# Altium project ARDUINO_BASED_DEVELOPMENT_BOAD.PrjPcb
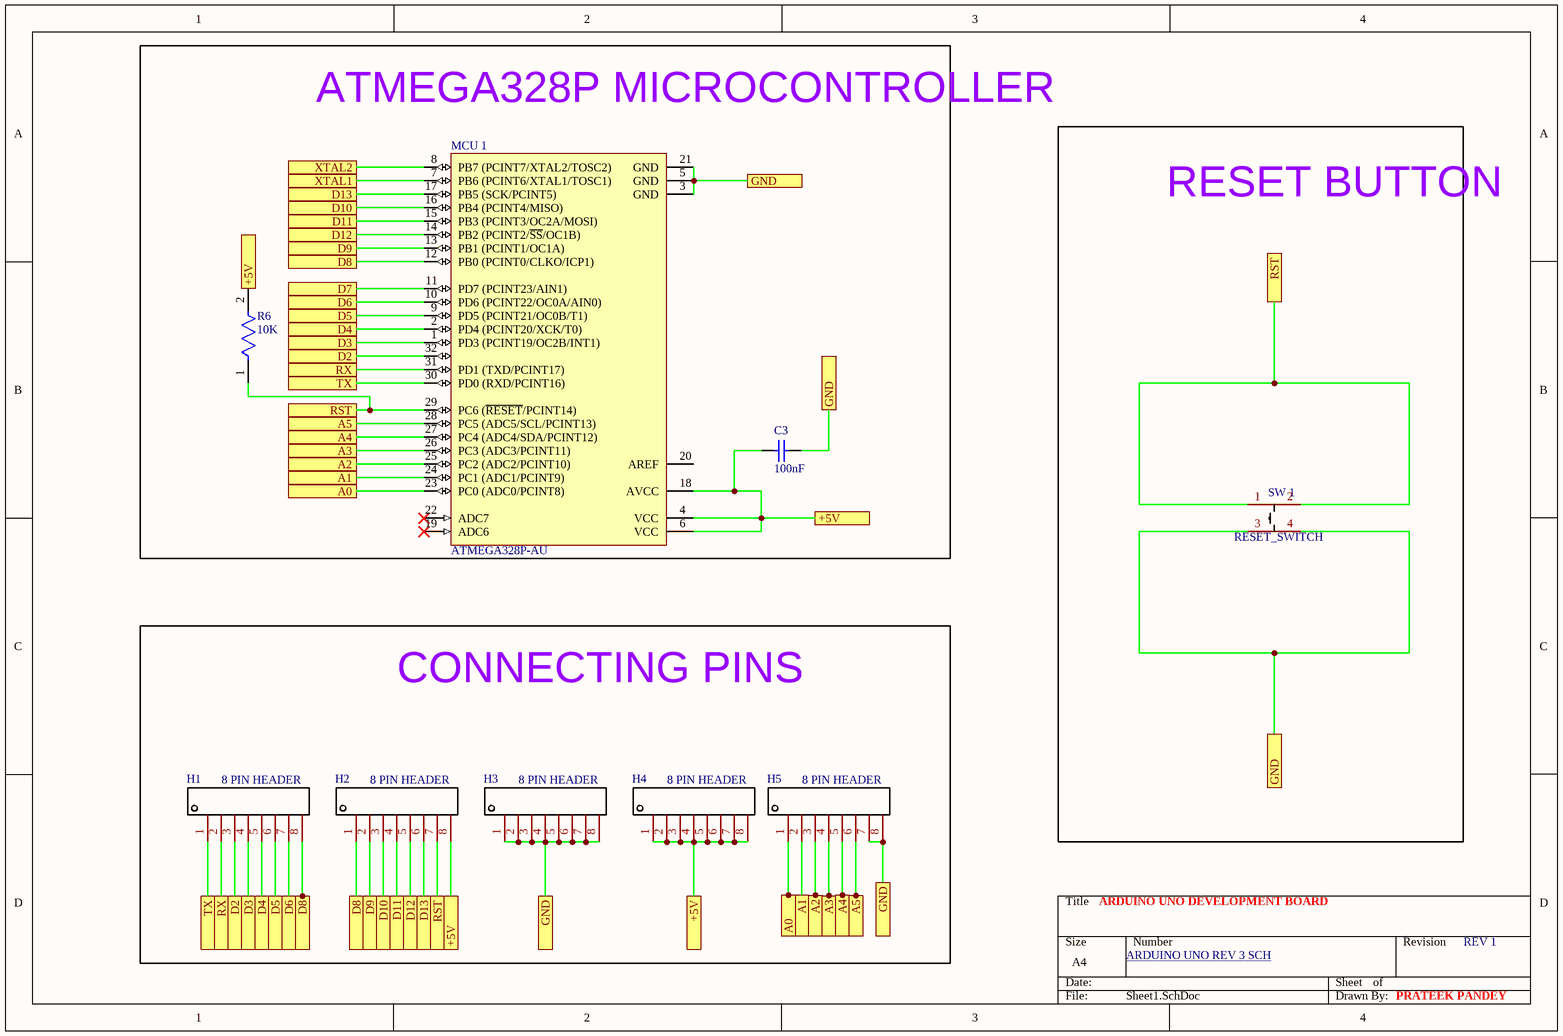
[diagram p0: Sheet1.SchDoc]
2 sheets, 32 parts. Net scope: flat (ports and power ports of the same name join across sheets).
Board file: PCB.PcbDoc
Sheets:
  Sheet1.SchDoc
  Sheet2.SchDoc

## Sheet Sheet1.SchDoc: ARDUINO BASED DEVELOPMENT BOARD
size A4; Author: PRATEEK PANDEY; DrawnBy: PRATEEK PANDEY; Engineer: PRATEEK PANDEY; SheetNumber: 1; SheetTotal: 2

### Parts
C3  100nF  [KEMT-1206-2_M]
H1  8 PIN HEADER  [PCBComponent_1]
H2  8 PIN HEADER  [PCBComponent_1]
H3  8 PIN HEADER  [PCBComponent_1]
H4  8 PIN HEADER  [PCBComponent_1]
H5  8 PIN HEADER  [PCBComponent_1]
MCU_1  ATMEGA328P-AU  [32A_M]
R6  10K  [FP-CR1206-IPC_B]
SW_1  RESET_SWITCH  [PCBComponent_1]

### Blocks framed on the sheet
ATMEGA328P MICROCONTROLLER: C3 MCU_1 R6
RESET BUTTON: SW_1
CONNECTING PINS: H1-H5

### Ports
+5V (see Sheet1[1B], Sheet1[2D], Sheet1[3C], Sheet2[3A], Sheet2[4A], Sheet2[4B], Sheet2[4C]), +5V (see Sheet1[1B], Sheet1[2D], Sheet2[3A], Sheet2[4A], Sheet2[4B], Sheet2[4C]), +5V (see Sheet1[2D], Sheet1[3C], Sheet2[3A], Sheet2[4A], Sheet2[4B], Sheet2[4C]), A0 (see Sheet1[1B]), A0 (see Sheet1[3D]), A1 (see Sheet1[1B]), A1 (see Sheet1[3D]), A2 (see Sheet1[1B]), A2 (see Sheet1[3D]), A3 (see Sheet1[1B]), A3 (see Sheet1[3D]), A4 (see Sheet1[1B]), A4 (see Sheet1[3D]), A5 (see Sheet1[1B]), A5 (see Sheet1[3D]), D2 (see Sheet1[1B]), D2 (see Sheet1[1D]), D3 (see Sheet1[1B]), D3 (see Sheet1[1D]), D4 (see Sheet1[1B]), D4 (see Sheet1[1D]), D5 (see Sheet1[1B]), D5 (see Sheet1[1D]), D6 (see Sheet1[1B]), D6 (see Sheet1[1D]), D7 (see Sheet1[1B]), D7 (see Sheet1[1D]), D8 (see Sheet1[1B], Sheet1[1D]), D8 (see Sheet1[1D]), D9 (see Sheet1[1A]), D9 (see Sheet1[1D]), D10 (see Sheet1[1A]), D10 (see Sheet1[1D]), D11 (see Sheet1[1A]), D11 (see Sheet1[2D]), D12 (see Sheet1[1A]), D12 (see Sheet1[2D]), D13 (see Sheet1[1A]), D13 (see Sheet1[2D]), GND (see Sheet1[2A], Sheet1[2D], Sheet1[3B], Sheet1[3D], Sheet2[1A], Sheet2[1D], Sheet2[3A], Sheet2[3B], Sheet2[4D]), GND (see Sheet1[2A], Sheet1[2D], Sheet1[3B], Sheet1[4D], Sheet2[1A], Sheet2[1D], Sheet2[3A], Sheet2[3B], Sheet2[4D]), GND (see Sheet1[2A], Sheet1[2D], Sheet1[3D], Sheet1[4D], Sheet2[1A], Sheet2[1D], Sheet2[3A], Sheet2[3B], Sheet2[4D]), GND (see Sheet1[2A], Sheet1[3B], Sheet1[3D], Sheet1[4D], Sheet2[1A], Sheet2[1D], Sheet2[3A], Sheet2[3B], Sheet2[4D]), GND (see Sheet1[2D], Sheet1[3B], Sheet1[3D], Sheet1[4D], Sheet2[1A], Sheet2[1D], Sheet2[3A], Sheet2[3B], Sheet2[4D]), RST (see Sheet1[1B], Sheet1[2D], Sheet2[3A]), RST (see Sheet1[1B], Sheet1[4B], Sheet2[3A]), RST (see Sheet1[2D], Sheet1[4B], Sheet2[3A]), RX (see Sheet1[1B], Sheet2[2A], Sheet2[4C]), RX (see Sheet1[1D], Sheet2[2A], Sheet2[4C]), TX (see Sheet1[1B], Sheet2[2A], Sheet2[4C]), TX (see Sheet1[1D], Sheet2[2A], Sheet2[4C]), XTAL1 (see Sheet2[1C]), XTAL2 (see Sheet2[2C])

### Nets
NetC1_1: C3.2 H2.8 H4.1 H4.2 H4.3 H4.4 H4.5 H4.6 H4.7 H4.8 MCU_1.4(VCC) MCU_1.6(VCC) MCU_1.18(AVCC) R6.2 ; port +5V
NetC1_2: C3.1 H3.1 H3.2 H3.3 H3.4 H3.5 H3.6 H3.7 H3.8 H5.7 H5.8 MCU_1.3(GND) MCU_1.5(GND) MCU_1.21(GND) SW_1.3 SW_1.4 ; port GND
NetC4_1: H2.7 MCU_1.29(PC6_(~{RESET}/PCINT14)) R6.1 SW_1.1 SW_1.2 ; port RST
NetC6_2: MCU_1.7(PB6_(PCINT6/XTAL1/TOSC1)) ; port XTAL1
NetC7_2: MCU_1.8(PB7_(PCINT7/XTAL2/TOSC2)) ; port XTAL2
NetH1_1: H1.1 MCU_1.30(PD0_(RXD/PCINT16)) ; port TX
NetH1_2: H1.2 MCU_1.31(PD1_(TXD/PCINT17)) ; port RX
NetH1_3: H1.3 MCU_1.32(PD2_(INT0/PCINT18)) ; port D2
NetH1_4: H1.4 MCU_1.1(PD3_(PCINT19/OC2B/INT1)) ; port D3
NetH1_5: H1.5 MCU_1.2(PD4_(PCINT20/XCK/T0)) ; port D4
NetH1_6: H1.6 MCU_1.9(PD5_(PCINT21/OC0B/T1)) ; port D5
NetH1_7: H1.7 MCU_1.10(PD6_(PCINT22/OC0A/AIN0)) ; port D6
NetH1_8: H1.8 H2.1 MCU_1.11(PD7_(PCINT23/AIN1)) MCU_1.12(PB0_(PCINT0/CLKO/ICP1)) ; port D7, port D8
NetH2_2: H2.2 MCU_1.13(PB1_(PCINT1/OC1A)) ; port D9
NetH2_3: H2.3 MCU_1.16(PB4_(PCINT4/MISO)) ; port D10
NetH2_4: H2.4 MCU_1.15(PB3_(PCINT3/OC2A/MOSI)) ; port D11
NetH2_5: H2.5 MCU_1.14(PB2_(PCINT2/~{SS}/OC1B)) ; port D12
NetH2_6: H2.6 MCU_1.17(PB5_(SCK/PCINT5)) ; port D13
NetH5_1: H5.1 MCU_1.23(PC0_(ADC0/PCINT8)) ; port A0
NetH5_2: H5.2 MCU_1.24(PC1_(ADC1/PCINT9)) ; port A1
NetH5_3: H5.3 MCU_1.25(PC2_(ADC2/PCINT10)) ; port A2
NetH5_4: H5.4 MCU_1.26(PC3_(ADC3/PCINT11)) ; port A3
NetH5_5: H5.5 MCU_1.27(PC4_(ADC4/SDA/PCINT12)) ; port A4
NetH5_6: H5.6 MCU_1.28(PC5_(ADC5/SCL/PCINT13)) ; port A5

Not connected (* = marked no-connect by the designer): MCU_1 19(ADC6)* 20(AREF) 22(ADC7)*

### Notes on the sheet
- ARDUINO UNO DEVELOPMENT BOARD
- ARDUINO UNO REV 3 SCH <https://docs.arduino.cc/resources/schematics/A000066-schematics.pdf>
- REV 1
- PRATEEK PANDEY

### Library data of the parts
C3 = CMP-1037-04202-2: CAP, Ceramic, 0.1 uF, +/- 10%, 50 V, -55 to 125 degC, 1206 (3216 Metric), RoHS, Tape and Reel; Manufacturer: Kemet; Voltage Rating: 50V; Capacitance: 0.1µF; Product Range: KEMET-CSeries; SVHC: ToBeAdvised; Dielectric Characteristic: X7R; Capacitor Case Style: 1206[3216Metric]; Package Reference: 1206-2; Package Description: 2-Leads SMD, Body 3.2 x 1.6 mm; Packaging: Tape&Reel; Operating Temperature Max: 125degC; Capacitance Tolerance: ±10%; Datasheet URL: https://datasheet.ciiva.com/6125/1725438-6125494.pdf; Manufacturer URL: http://www.kemet.com/; Operating Temperature Min: -55degC; Datasheet Version: Jul-13
MCU_1 = CMP-0095-00269-2: 8-bit AVR Microcontroller, 32KB Flash, 1KB EEPROM, 2KB SRAM, 32-pin TQFP, Industrial Grade (-40°C to 85°C); PackageDescription: 32-Lead, 7x7x1.0 mm Body, 0.8mm Lead Pitch, Thin Profile Plastic Quad Flat Package (TQFP); DatasheetVersion: revD, May-2011; RevisionNote: DatasheetVersion & PackageVersion updated. URLs added.; ComponentLink1URL: http://www.atmel.com/; ComponentLink2Description: ATmega48A/48PA/88A/88PA/168A/168PA/328/328P Datasheet; Code_JEDEC: MS-026-ABA; ComponentLink1Description: Manufacturer URL; PackageReference: 32A; ComponentLink3Description: ATmega48A/48PA/88A/88PA/168A/168PA/328/328P Summary; ComponentLink2URL: http://www.atmel.com/dyn/resources/prod_documents/doc8271.pdf; PackageVersion: revC, Oct-2010; ComponentLink3URL: http://www.atmel.com/dyn/resources/prod_documents/8271S.pdf
R6 = CMP-07231-005593-1: Thick Film Chip Resistors 1206 10kΩ 0.25W 5% 200ppm/°C; Voltage Rating: 200V; Resistance: 10kR; Max Power Dissipation: 250mW; Temperature Coefficient: 200ppm/°C; Height: 0.6mm; Case Code (Imperial): 1206; REACH SVHC: No SVHC; Depth: 1.6mm; Mount: Surface Mount; Termination: SMD/SMT; Case/Package: 1206; Min Operating Temperature: -55°C; Features: Moisture Resistant; Number of Pins: 2; Length: 3.2mm; Military Standard: Not; Radiation Hardening: No; Max Operating Temperature: 155°C; Power Rating: 250mW; Case Code (Metric): 3216; Package Quantity: 1; Composition: Thick Film; Tolerance: 5%; Voltage Rating (DC): 200V; Contact Plating: Tin; Thickness: 610um; Number of Terminations: 2; Packaging: Tape and Reel; Width: 1.6mm
SW_1 = Component_1

## Sheet Sheet2.SchDoc
size A4; SheetNumber: 2; SheetTotal: 2
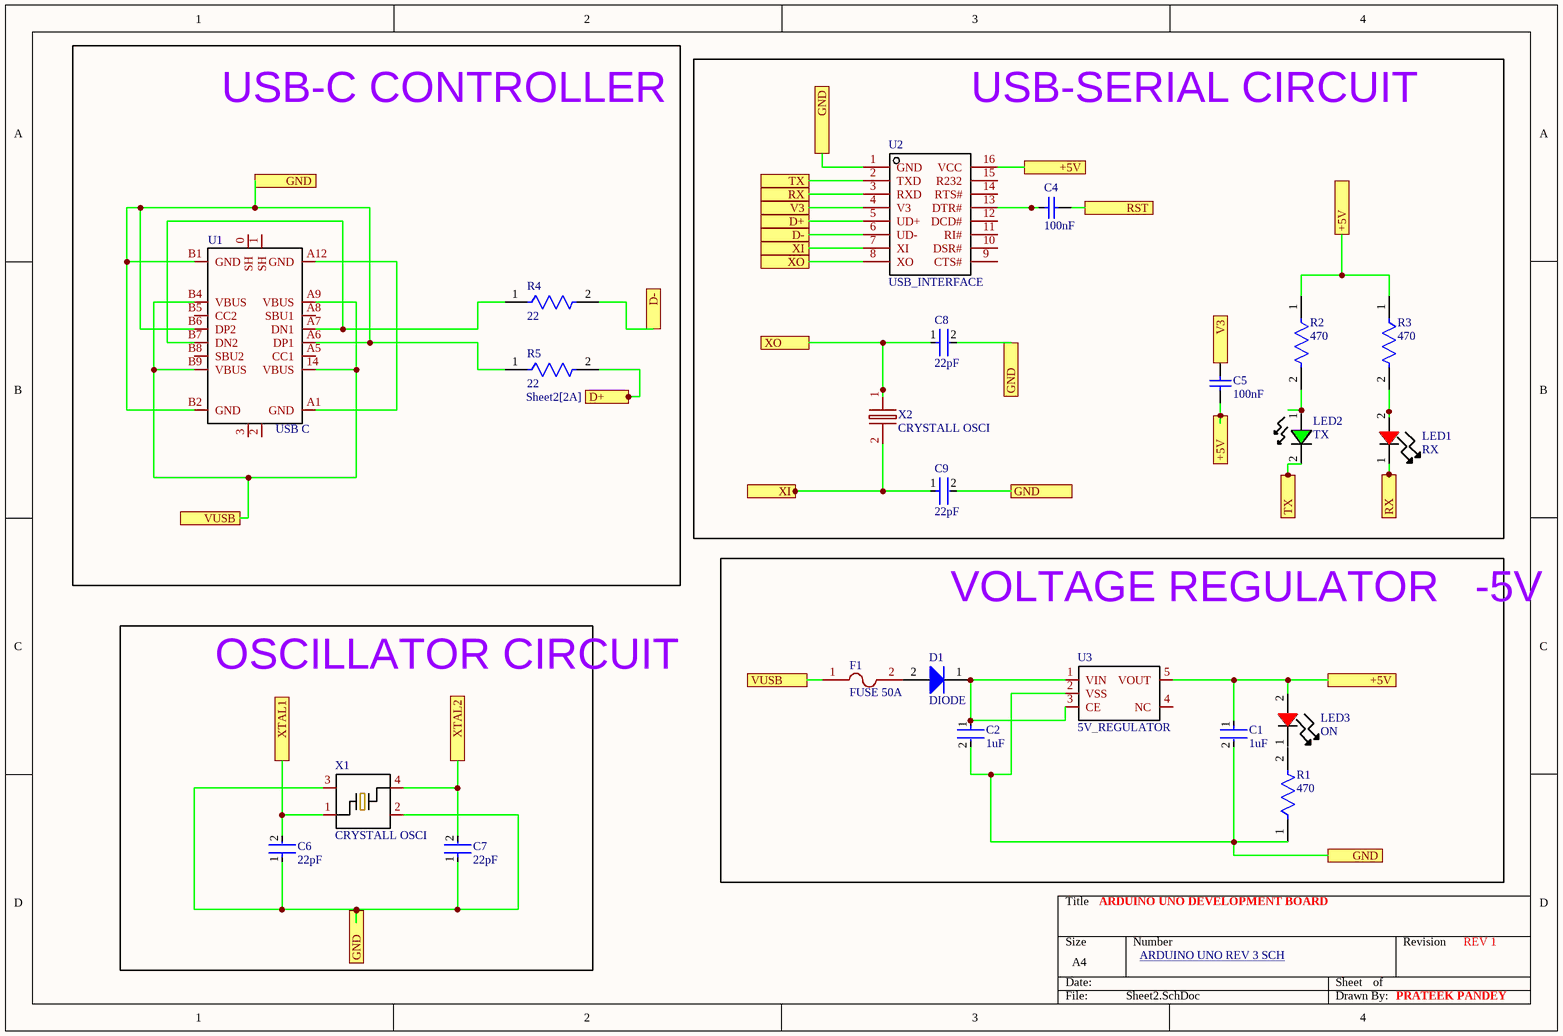
[diagram p1: Sheet2.SchDoc]

### Parts
C1  1uF  [FP-0805-L_2_01_0_2-W_1_25-MFG]
C2  1uF  [FP-0805-L_2_01_0_2-W_1_25-MFG]
C4  100nF  [KEMT-1206-2_M]
C5  100nF  [KEMT-1206-2_M]
C6  22pF  [FP-C0805C-DN-MFG]
C7  22pF  [FP-C0805C-DN-MFG]
C8  22pF  [FP-C0805C-DN-MFG]
C9  22pF  [FP-C0805C-DN-MFG]
D1  DIODE  [ONSC-DSN-2-152AC-01_V]
F1  FUSE 50A  [PCBComponent_1]
LED1  RX  [LED_LSM0805-2P0X1P25X0P8_VCC]
LED2  TX  [LED_05452V_VCC-M]
LED3  ON  [LED_LSM0805-2P0X1P25X0P8_VCC]
R1  470  [FP-CR0805-MFG]
R2  470  [FP-CR0805-MFG]
R3  470  [FP-CR0805-MFG]
R4  22  [FP-CR0603-IPC_A]
R5  22  [FP-CR0603-IPC_A]
U1  USB C  [PCBComponent_1]
U2  USB_INTERFACE  [PCBComponent_1]
U3  5V_REGULATOR  [PCBComponent_1]
X1  CRYSTALL OSCI  [PCBComponent_1]
X2  CRYSTALL OSCI  [PCBComponent_1]

### Blocks framed on the sheet
USB-C CONTROLLER: R4 R5 U1
USB-SERIAL CIRCUIT: C4 C5 C8 C9 LED1 LED2 R2 R3 U2 X2
VOLTAGE REGULATOR   -5V: C1 C2 D1 F1 LED3 R1 U3
OSCILLATOR CIRCUIT: C6 C7 X1

### Ports
+5V (see Sheet1[1B], Sheet1[2D], Sheet1[3C], Sheet2[3A], Sheet2[4A], Sheet2[4B]), +5V (see Sheet1[1B], Sheet1[2D], Sheet1[3C], Sheet2[3A], Sheet2[4A], Sheet2[4C]), +5V (see Sheet1[1B], Sheet1[2D], Sheet1[3C], Sheet2[3A], Sheet2[4B], Sheet2[4C]), +5V (see Sheet1[1B], Sheet1[2D], Sheet1[3C], Sheet2[4A], Sheet2[4B], Sheet2[4C]), D+ (see Sheet2[2A]), D+ (see Sheet2[2B]), D- (see Sheet2[2A]), D- (see Sheet2[2B]), GND (see Sheet1[2A], Sheet1[2D], Sheet1[3B], Sheet1[3D], Sheet1[4D], Sheet2[1A], Sheet2[1D], Sheet2[3A], Sheet2[3B]), GND (see Sheet1[2A], Sheet1[2D], Sheet1[3B], Sheet1[3D], Sheet1[4D], Sheet2[1A], Sheet2[1D], Sheet2[3A], Sheet2[3B], Sheet2[4D]), GND (see Sheet1[2A], Sheet1[2D], Sheet1[3B], Sheet1[3D], Sheet1[4D], Sheet2[1A], Sheet2[1D], Sheet2[3B], Sheet2[4D]), GND (see Sheet1[2A], Sheet1[2D], Sheet1[3B], Sheet1[3D], Sheet1[4D], Sheet2[1A], Sheet2[3A], Sheet2[3B], Sheet2[4D]), GND (see Sheet1[2A], Sheet1[2D], Sheet1[3B], Sheet1[3D], Sheet1[4D], Sheet2[1D], Sheet2[3A], Sheet2[3B], Sheet2[4D]), RST (see Sheet1[1B], Sheet1[2D], Sheet1[4B]), RX (see Sheet1[1B], Sheet1[1D], Sheet2[2A]), RX (see Sheet1[1B], Sheet1[1D], Sheet2[4C]), TX (see Sheet1[1B], Sheet1[1D], Sheet2[2A]), TX (see Sheet1[1B], Sheet1[1D], Sheet2[4C]), V3 (see Sheet2[2A]), V3 (see Sheet2[4B]), VUSB (see Sheet2[1C]), VUSB (see Sheet2[2C]), XI (see Sheet2[2A]), XI (see Sheet2[2B]), XO (see Sheet2[2B]), XTAL1 (see Sheet1[1A]), XTAL2 (see Sheet1[1A])

### Nets
NetC1_1: C1.1 C5.2 LED3.2(+) R2.1 R3.1 U2.16(VCC) U3.5(VOUT) ; port +5V
NetC1_2: C1.2 C2.2 C6.1 C7.1 C8.2 C9.2 R1.1 R5.1 U1.A6(DP1) U1.B1(GND) U1.B2(GND) U1.B6(DP2) U2.1(GND) U3.2(VSS) X1.2 X1.3 ; port GND
NetC2_1: C2.1 D1.1(K) U3.1(VIN) U3.3(CE)
NetC4_1: C4.1 ; port RST
NetC4_2: C4.2 U2.13(DTR#)
NetC5_1: C5.1 U2.4(V3) ; port V3
NetC6_2: C6.2 X1.1 ; port XTAL1
NetC7_2: C7.2 X1.4 ; port XTAL2
NetC8_1: C8.1 U2.8(XO) X2.1 ; port XO
NetC9_1: C9.1 U2.7(XI) X2.2 ; port XI
NetD1_2: D1.2(A) F1.2
NetF1_1: F1.1 U1.14(VBUS) U1.A9(VBUS) U1.B4(VBUS) U1.B9(VBUS) ; port VUSB
NetH1_1: LED2.2 U2.2(TXD) ; port TX
NetH1_2: LED1.1(-) U2.3(RXD) ; port RX
NetLED1_2: LED1.2(+) R3.2
NetLED2_1: LED2.1 R2.2
NetR4_1: R4.1 U1.A7(DN1) U1.B7(DN2)
NetR4_2: R4.2 U2.6(UD-) ; port D-
NetR5_2: R5.2 U2.5(UD+) ; port D+
NetU1_A1: U1.A1(GND) U1.A12(GND)

Not connected (* = marked no-connect by the designer): LED3 1(-); R1 2; U1 0(SH) 1(SH) 2 3 A5(CC1) A8(SBU1) B5(CC2) B8(SBU2); U2 9(CTS#) 10(DSR#) 11(RI#) 12(DCD#) 14(RTS#) 15(R232); U3 4(NC)

### Notes on the sheet
- ARDUINO UNO DEVELOPMENT BOARD
- ARDUINO UNO REV 3 SCH <https://docs.arduino.cc/resources/schematics/A000066-schematics.pdf>
- REV 1
- PRATEEK PANDEY

### Library data of the parts
C1 C2 = CMP-2007-04692-2: General Purpose Ceramic Capacitor, 0805, 1uF, 10%, X7R, 15%, 25V; Max Operating Temperature: 125°C; Contact Plating: Tin; Tolerance: 10%; Dielectric: X7R; Case/Package: 0805; Package Quantity: 3000; Width: 0.049inch; Voltage Rating: 25V; Capacitance: 1uF; Lead Free: Lead Free; REACH SVHC: No SVHC; RoHS Compliant: Yes; Case Code (Imperial): 0805; Packaging: Tape and Reel; Dielectric Material: Ceramic; Series: -; Construction: Flat; Termination: SMD/SMT; Radiation Hardening: No; Voltage: 25V; Height: 1.4mm; Number of Pins: 2; Mount: Surface Mount; Length: 2.01mm; Depth: 1.25mm; Voltage Rating (DC): 25V; Min Operating Temperature: -55°C; Thickness: 0.037inch; Case Code (Metric): 2012
C4 C5 = CMP-1037-04202-2: as C3 on sheet Sheet1; Package Reference: 1206-2; Package Description: 2-Leads SMD, Body 3.2 x 1.6 mm; Packaging: Tape&Reel; Operating Temperature Max: 125degC; Capacitance Tolerance: ±10%; Datasheet URL: https://datasheet.ciiva.com/6125/1725438-6125494.pdf; Manufacturer URL: http://www.kemet.com/; Operating Temperature Min: -55degC; Datasheet Version: Jul-13
C6-C9 = CMP-2007-00048-2: Capacitor; Ceramic; Cap; 22.0pF; Tol 5%; SMT; Vol-Rtg 50V; C0G; Tape and Reel; Manufacturer: KEMET; Manufacturer Part Number: C0805C220J5GACTU; Temperature Coefficient: 30ppm/°C; Tolerance: 0.05; Device Class L1: Passive Components; Mouser Description: Multilayer Ceramic Capacitors MLCC - SMD/SMT 50volts 22pF C0G 5%; Temperature Range Low: -55°C; Automotive: No; Voltage Rating: 50 V; Material: Ceramic; Category: Cap; Height: 0.88mm; Temperature Range High: +125°C; Capacitance: 22 pF; Digikey Description: Capacitor; Ceramic; Cap; 22.0pF; Tol 5%; SMT; Vol-Rtg 50V; C0G; Tape and Reel; Octopart: https://octopart.com/c0805c220j5gactu-kemet-145470; ComponentLink2Description: Datasheet; Device Class L2: Capacitors; Ipc Land Pattern Name: CAPC200125X78; Value: 22 pF; RoHS: TRUE; ComponentLink2URL: https://content.kemet.com/datasheets/KEM_C1003_C0G_SMD.pdf; Temperature: -55°C to +125°C; Device Class L3: Ceramic Capacitors; Lead Free: Yes; Temperature Characteristic: C0G; Package: C0805C-DN
D1 = CMP-1055-00232-1: Schottky Barrier Diode, 2-Pin DSN, Pb-Free, Tape and Reel; Manufacturer: On Semiconductor; PartNumber: NSR05F40NXT5G; IFSM Max (A): 10; Configuration: Single; RoHS: TRUE; PackageVersion: Rev. C, 01/2011; ComponentLink3Description: Package Specification; ComponentLink3URL: http://www.onsemi.cn/pub_link/Collateral/152AC.PDF; PackageDescription: 2-Pin Micro Molded Package, Body 1 x 0.6 mm; ComponentLink1URL: http://www.onsemi.com/; ComponentLink1Description: Manufacturer URL; Mounting Technology: Surface Mount; Packing: Tape and Reel; PackageReference: DSN-2-152AC-01; ComponentLink2Description: Datasheet; DatasheetVersion: Rev. 3; ComponentLink2URL: http://www.onsemi.cn/pub_link/Collateral/NSR05F40.PDF
F1 LED1 LED3 U1-U3 X1 X2 = Component_1
LED2 = LSM0805452V: No Description Available; Mfr_Name: VCC
R1-R3 = CMP-07231-001047-1: Thick Film Chip Resistors 0805 470Ω 0.125W 5% 200ppm/°C; Voltage Rating: 150V; Power Rating: 125mW; Resistance: 470R; Max Operating Temperature: 155°C; Depth: 1.25mm; Case Code (Metric): 2012; Mount: Surface Mount; Length: 2mm; REACH SVHC: No SVHC; Case/Package: 0805; Packaging: Tape and Reel; Contact Plating: Tin; Voltage Rating (DC): 150V; Width: 1.25mm; Number of Pins: 2; Termination: SMD/SMT; Height: 0.5mm; Package Quantity: 5000; Min Operating Temperature: -55°C; Lead Free: Contains Lead; Composition: Thick Film; Tolerance: 5%; Temperature Coefficient: 200ppm/°C; Case Code (Imperial): 0805; Radiation Hardening: No; Thickness: 508um; Military Standard: Not
R4 R5 = CMP-07231-005384-1: Thick Film Chip Resistors 0603 22Ω 0.1W 5% 200ppm/°C; Voltage Rating (DC): 50V; Resistance: 22R; Max Power Dissipation: 100mW; Features: Moisture Resistant; REACH SVHC: No SVHC; Height: 0.022inch; Composition: Thick Film; Case/Package: 0603; Packaging: Tape and Reel; Package Quantity: 1; Number of Pins: 2; Min Operating Temperature: -55°C; Depth: 0.8mm; Contact Plating: Tin; Termination: SMD/SMT; Radiation Hardening: No; Max Operating Temperature: 155°C; Case Code (Metric): 1608; Length: 1.6mm; Voltage Rating: 50V; Tolerance: 5%; Mount: Surface Mount; Military Standard: Not; Power Rating: 100mW; Number of Terminations: 2; Case Code (Imperial): 0603; Thickness: 457um; Width: 0.8mm; Temperature Coefficient: 200ppm/°C

## Nets that join several sheets
NetC1_1: Sheet1 (14 pins), Sheet2 (7 pins)
NetC1_2: Sheet1 (16 pins), Sheet2 (16 pins)
NetC4_1: Sheet1 (5 pins), Sheet2 (C4.1)
NetC6_2: Sheet1 (MCU_1.7), Sheet2 (C6.2 X1.1)
NetC7_2: Sheet1 (MCU_1.8), Sheet2 (C7.2 X1.4)
NetH1_1: Sheet1 (H1.1 MCU_1.30), Sheet2 (LED2.2 U2.2)
NetH1_2: Sheet1 (H1.2 MCU_1.31), Sheet2 (LED1.1 U2.3)